# Altium schematic sheet Control.SchDoc
size A4
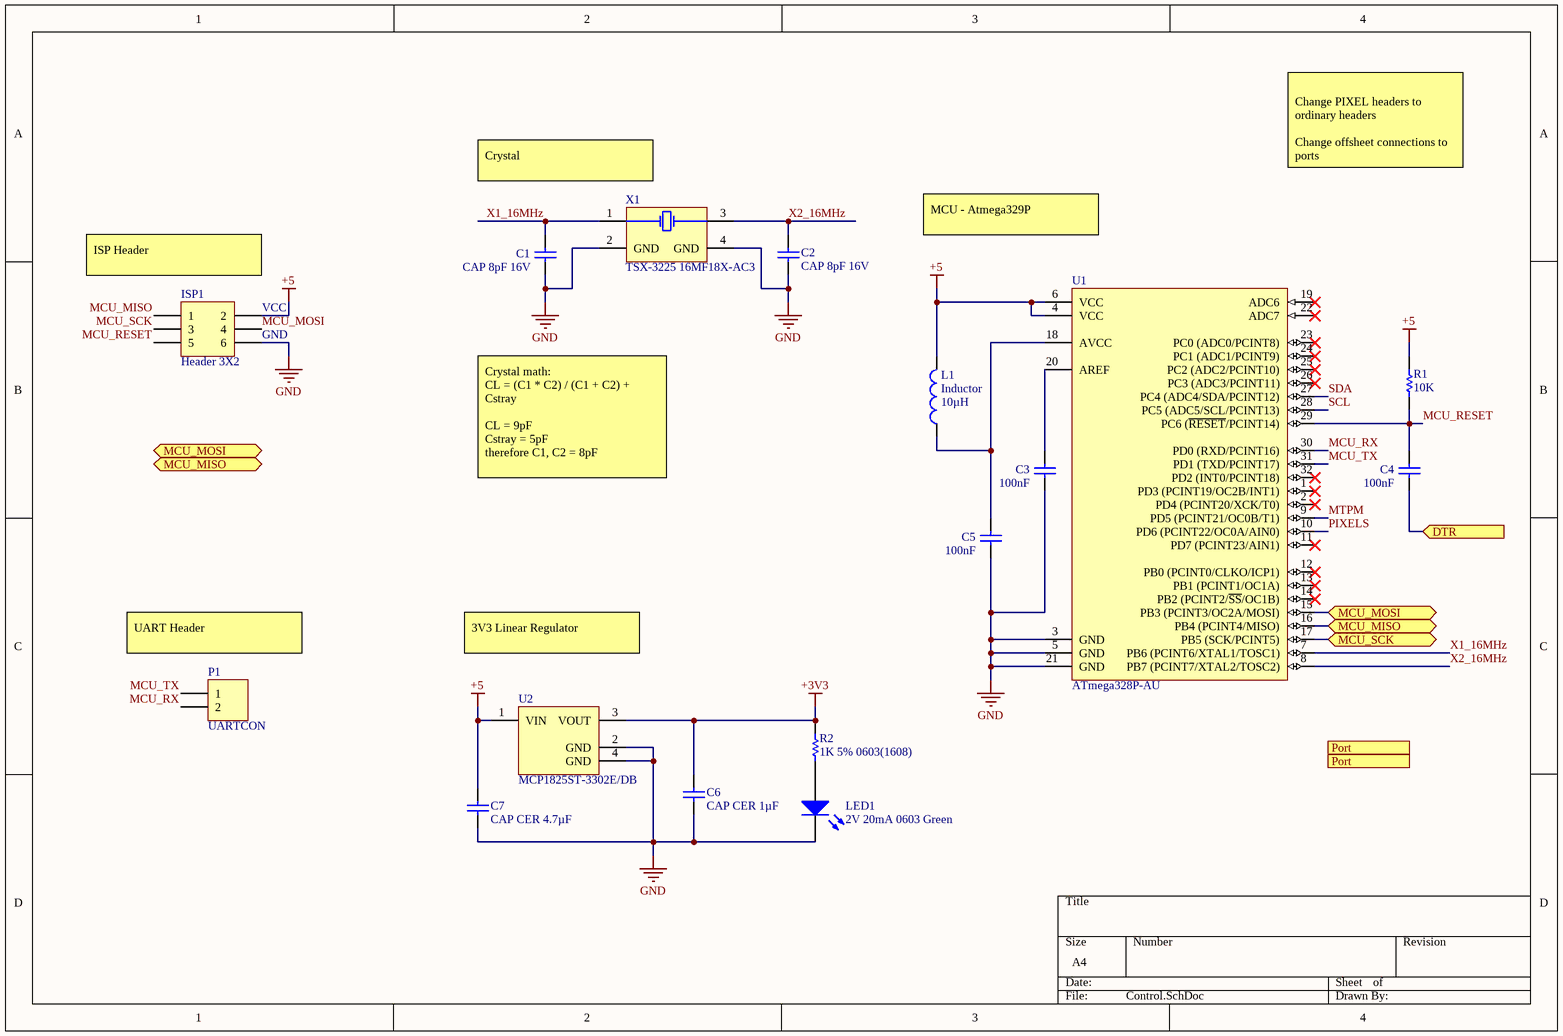
[diagram p0: Control.SchDoc]

## Parts
C1  CAP 8pF 16V  [CAPC0603(1608)100_N]
C2  CAP 8pF 16V  [CAPC0603(1608)100_N]
C3  100nF  [CAPC0603(1608)100_M]
C4  100nF  [CAPC0603(1608)100_M]
C5  100nF  [CAPC0603(1608)100_M]
C6  CAP CER 1µF  [CAPC1608X90X20LL10]
C7  CAP CER 4.7µF  [CAPC1608X90X35NL10T15]
ISP1  Header 3X2  [HDR2X3]
L1  Inductor  value 10µH  [0603]
LED1  2V 20mA 0603 Green  [0603_A]
P1  UARTCON  [HDR1X2]
R1  10K  [RESC0603(1608)_N]
R2  1K 5% 0603(1608)  [RESC0603(1608)_L]
U1  ATmega328P-AU  [32A_M]
U2  MCP1825ST-3302E/DB  [SOT-223-DB3_L]
X1  TSX-3225 16MF18X-AC3  [EPSON-TSX-3225_V]

## Ports
DTR (in), MCU_MISO (bidir), MCU_MOSI (bidir), MCU_SCK (bidir), Port

## Nets
+3V3: C6.2 R2.2 U2.3(VOUT)
+5: C7.2 ISP1.2 L1.2 R1.2 U1.4(VCC) U1.6(VCC) U2.1(VIN)
GND: C1.1 C2.2 C3.1 C5.1 C6.1 C7.1 ISP1.6 LED1.1(K) U1.3(GND) U1.5(GND) U1.21(GND) U2.2(GND) U2.4(GND) X1.2(GND) X1.4(GND)
DTR: C4.1 ; port DTR
MCU_MISO: ISP1.1
MCU_MISO: U1.16(PB4_(PCINT4/MISO)) ; port MCU_MISO  [a separate net that carries the same name]
MCU_MOSI: ISP1.4
MCU_MOSI: U1.15(PB3_(PCINT3/OC2A/MOSI)) ; port MCU_MOSI  [a separate net that carries the same name]
MCU_RESET: C4.2 ISP1.5 R1.1 U1.29(PC6_(~{RESET}/PCINT14))
MCU_RX: P1.2 U1.30(PD0_(RXD/PCINT16))
MCU_SCK: ISP1.3
MCU_SCK: U1.17(PB5_(SCK/PCINT5)) ; port MCU_SCK  [a separate net that carries the same name]
MCU_TX: P1.1 U1.31(PD1_(TXD/PCINT17))
MTPM: U1.9(PD5_(PCINT21/OC0B/T1))
PIXELS: U1.10(PD6_(PCINT22/OC0A/AIN0))
SCL: U1.28(PC5_(ADC5/SCL/PCINT13))
SDA: U1.27(PC4_(ADC4/SDA/PCINT12))
X1_16MHz: C1.2 U1.7(PB6_(PCINT6/XTAL1/TOSC1)) X1.1(X1)
X2_16MHz: C2.1 U1.8(PB7_(PCINT7/XTAL2/TOSC2)) X1.3(X2)
NetC3_2: C3.2 U1.20(AREF)
NetC5_2: C5.2 L1.1 U1.18(AVCC)
NetLED1_2: LED1.2(A) R2.1

Not connected (* = marked no-connect by the designer): U1 1(PD3_(PCINT19/OC2B/INT1))* 2(PD4_(PCINT20/XCK/T0))* 11(PD7_(PCINT23/AIN1))* 12(PB0_(PCINT0/CLKO/ICP1))* 13(PB1_(PCINT1/OC1A))* 14(PB2_(PCINT2/~{SS}/OC1B))* 19(ADC6)* 22(ADC7)* 23(PC0_(ADC0/PCINT8))* 24(PC1_(ADC1/PCINT9))* 25(PC2_(ADC2/PCINT10))* 26(PC3_(ADC3/PCINT11))* 32(PD2_(INT0/PCINT18))*

## Notes on the sheet
- (near X1) Crystal
- Change PIXEL headers to ordinary headers
  Change offsheet connections to ports
- MCU - Atmega329P
- (near ISP1) ISP Header
- (near ISP1) VCC
- (near ISP1) GND
- Crystal math:
  CL = (C1 * C2) / (C1 + C2) + Cstray
  CL = 9pF
  Cstray = 5pF
  therefore C1, C2 = 8pF
- (near P1) UART Header
- 3V3 Linear Regulator

## Library data of the parts
C1 C2 = CMP-1035-00808-1: CAP 22pF 16V ±5% 0603 (1608 Metric) Thickness 1mm SMD; Tolerance: Â±5%; Case-EIA: 0603; Case-Metric: 1608; Technology: SMT; Value: 22pF; Rated Voltage: 16 V; Max Thickness: 1 mm
C3-C5 = CMP-1035-02583-1: CAP 100nF 16V ±5% 0603 (1608 Metric) Thickness 1mm SMD; Tolerance: Â±5%; Case-Metric: 1608; Case-EIA: 0603; Rated Voltage: 16 V; Max Thickness: 1 mm; Technology: SMT; Value: 100nF
C6 = CMP-2000-06025-1: Chip Capacitor, 1 uF, +/- 10%, 50 V, -55 to 85 degC, 0603 (1608 Metric), RoHS, Tape and Reel / C1608X5R1H105K080AB; Manufacturer: TDK; PCN Part Number: MLCCPartNumberChange30/Nov/2012; Other Names: 445-7468-6; Online Catalog: CSeries,GeneralPurpose; Product Training Modules: CSeriesGeneralApplicationsSEAT,CCV,andTVCLDesignToolsGuidetoReplacinganElectrolyticCapacitorwithanMLCC; Voltage - Rated: 50V; Design Resources: 20WNon-IsolatedBuckLEDDriverUsingPLLNK460KG; Temperature Coefficient: X5R; Series: C; Datasheet Version: 08/2016; Package Description: 2-Pin Surface Mount Device, Body 1.6 x 0.8 mm; Mounting Technology: SurfaceMount; Capacitance: 1µF; Features: -; Size / Dimension: 0.063"Lx0.031"W(1.60mmx0.80mm); Lead Spacing: -; Operating Temperature: -55°C~85°C; Tolerance: ±10%; Height - Seated (Max): -; Mounting Type: SurfaceMount,MLCC; Ratings: -; Standard Package: 1; Applications: GeneralPurpose; Datasheet URL: https://product.tdk.com/info/en/catalog/datasheets/mlcc_commercial_general_en.pdf; Category: Capacitors; Lead Style: -; Packaging: Digi-Reel®; RoHS Information: RoHSCertificate-MLCC; Package / Case: 0603(1608Metric); Package Reference: 0603; Manufacturer URL: http://www.tdk.com/; Thickness (Max): 0.035"(0.90mm); Family: CeramicCapacitors
C7 = CMP-2006-02523-1: GRM188R61E475KE11D; Manufacturer: Murata; Part Number: GRM188R61E475KE11D
ISP1 = Header 3X2: Header, 3-Pin, Dual row; LatestRevisionDate: 17-Jul-2002; LatestRevisionNote: Re-released for DXP Platform.; Publisher: Altium Limited
L1 = Inductor: Code_IEC: 1005; Published: 8-Jun-2000; LatestRevisionDate: 29-May-2009; LatestRevisionNote: IPC-7351 Footprint Added.; PackageReference: 0402-A; Publisher: Altium Limited; PackageDescription: Chip Inductor; Code_JEITA: 0402
LED1 = CMP-1426-00001-1: SMD mono-color Chip LED, WL-SMCW, Red; Manufacturer: Wuerth Elektronik; PartNumber: 150060RS75000; Color: Red; PackageReference: 0603_A; ComponentLink2URL: http://katalog.we-online.com/led/datasheet/150060RS75000.pdf; ComponentLink1URL: http://www.we-online.com; ComponentLink1Description: Manufacturer URL; ComponentLink2Description: Datasheet
P1 = Header 2: Header, 2-Pin; LatestRevisionDate: 17-Jul-2002; LatestRevisionNote: Re-released for DXP Platform.; Publisher: Altium Limited
R1 = CMP-1012-00098-1: 10K 0.1W 5% 0603 (1608 Metric)  SMD; Case-EIA: 0603; Value: 10000.00 Ohm; Case-Metric: 1608; Technology: SMT; Tolerance: 5 %; Power: 0.1 W
R2 = CMP-1012-00074-1: 1K 0.1W 5% 0603 (1608 Metric)  SMD; Case-EIA: 0603; Case-Metric: 1608; Value: 1000.00 Ohm; Technology: SMT; Tolerance: 5 %; Power: 0.1 W
U1 = CMP-0095-00269-2: 8-bit AVR Microcontroller, 32KB Flash, 1KB EEPROM, 2KB SRAM, 32-pin TQFP, Industrial Grade (-40°C to 85°C); PackageDescription: 32-Lead, 7x7x1.0 mm Body, 0.8mm Lead Pitch, Thin Profile Plastic Quad Flat Package (TQFP); DatasheetVersion: revD, May-2011; RevisionNote: DatasheetVersion & PackageVersion updated. URLs added.; ComponentLink1URL: http://www.atmel.com/; ComponentLink2Description: ATmega48A/48PA/88A/88PA/168A/168PA/328/328P Datasheet; Code_JEDEC: MS-026-ABA; ComponentLink1Description: Manufacturer URL; PackageReference: 32A; ComponentLink3Description: ATmega48A/48PA/88A/88PA/168A/168PA/328/328P Summary; ComponentLink2URL: http://www.atmel.com/dyn/resources/prod_documents/doc8271.pdf; PackageVersion: revC, Oct-2010; ComponentLink3URL: http://www.atmel.com/dyn/resources/prod_documents/8271S.pdf
U2 = CMP-0136-00486-1: 500 mA, Low Voltage, Low Quiescent Current LDO Regulator, 3-Pin SOT-223, Extended Temperature, Tape and Reel; DatasheetVersion: revB, Feb-2008; PackageReference: SOT-223-DB3; PackageVersion: revBB, Aug-2009; PackageDescription: 3-Lead Plastic Small Outline Transistor (DB) [SOT-223]
X1 = CMP-2000-07332-1: MHz Range Crystal Unit, 16 MHz, -40 to 85 degC, 4-Pin SMD, RoHS, Tape and Reel; Manufacturer: Epson; Unit Weight: 0.000564oz; Tolerance: 10PPM; ESR: 60Ohms; Frequency: 16MHz; Drive Level: 200uW; Brand: EpsonTiming; Load Capacitance: 9pF; Product Category: Crystals; Packaging: Reel; Termination Style: SMD/SMT; Width: 2.5mm; Length: 3.2mm; Type: Crystal; Datasheet Version: 12/2015; Factory Pack Quantity: 250; Package Description: 4-Pin Surface Mount Device, Body 3.2 x 2.5 mm; Package / Case: 3.2mmx2.5mm; Mounting Style: SMD/SMT; Series: TSX-3225; Frequency Stability: 10PPM; Package Reference: TSX-3225; Mounting Technology: SurfaceMount; RoHS: True; Height: 0.6mm; Datasheet URL: https://support.epson.biz/td/api/doc_check.php?dl=brief_FA-238V_en.pdf; Operating Temperature Range: -40Cto+85C; Manufacturer URL: https://www.eea.epson.com/